# EAGLE design Terminal Batere (EAGLE 5.06)
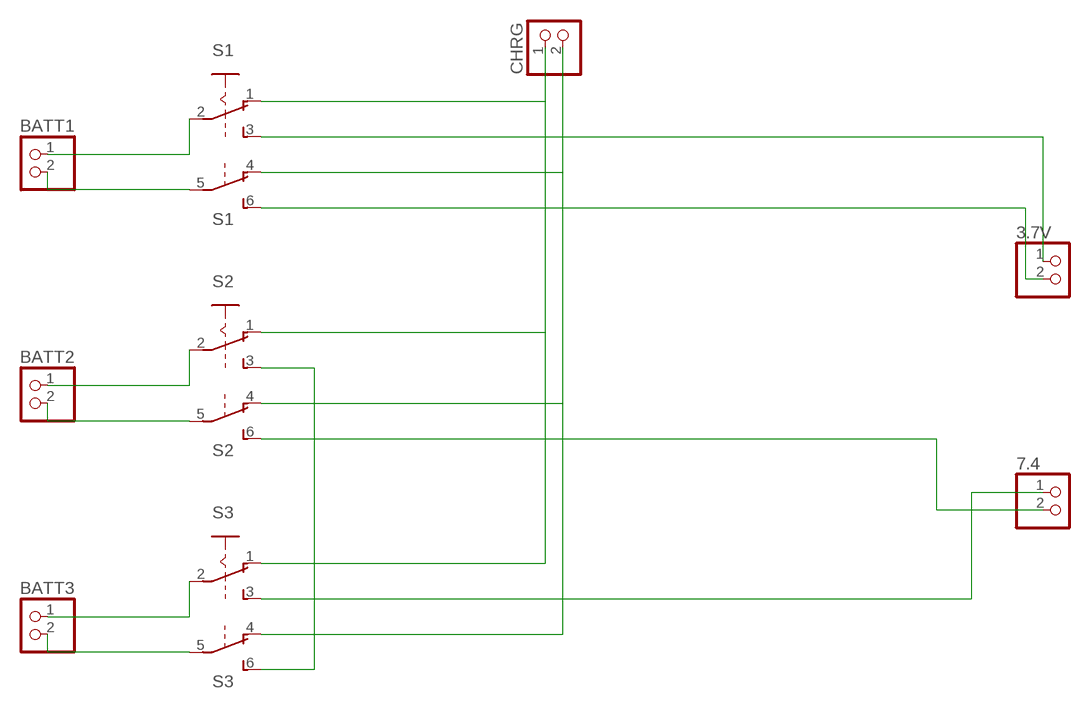
[diagram p0: schematic, sheet 1]

## Parts
3.7V  PINHD-1X2  [1X02]
7.4  PINHD-1X2  [1X02]
BATT1  PINHD-1X2  [1X02]
BATT2  PINHD-1X2  [1X02]
BATT3  PINHD-1X2  [1X02]
CHRG  PINHD-1X2  [1X02]
S1  A68-A31  [A68-A31]
S2  A68-A31  [A68-A31]
S3  A68-A31  [A68-A31]

## Nets
N$1: BATT1.1 S1.2(A:P)
N$2: BATT1.2 S1.5(B:P)
N$3: BATT2.1 S2.2(A:P)
N$4: BATT2.2 S2.5(B:P)
N$5: BATT3.1 S3.2(A:P)
N$6: BATT3.2 S3.5(B:P)
N$7: CHRG.1 S1.1(A:O) S2.1(A:O) S3.1(A:O)
N$8: CHRG.2 S1.4(B:O) S2.4(B:O) S3.4(B:O)
N$9: 3.7V.1 S1.3(A:S)
N$10: 3.7V.2 S1.6(B:S)
N$11: S2.3(A:S) S3.6(B:S)
N$12: 7.4.2 S2.6(B:S)
N$13: 7.4.1 S3.3(A:S)

## Library data of the parts
3.7V 7.4 BATT1-BATT3 CHRG = pinhead:PINHD-1X2: PIN HEADER
S1-S3 = switch:A68-A31: SLIDING SWITCH Siemens, distributor Buerklin, 11G766

## Board
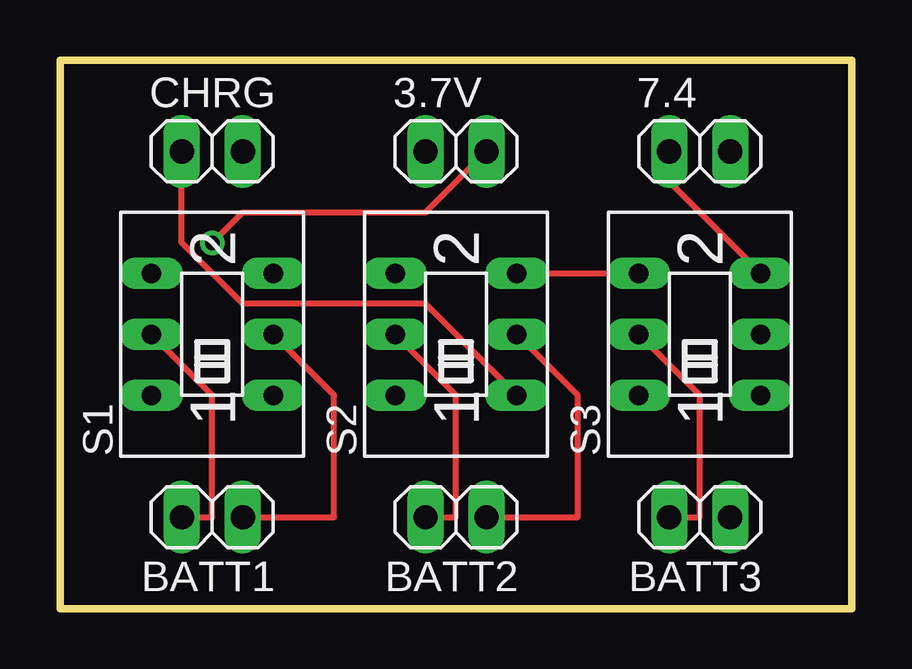
[diagram p1: board, top side]
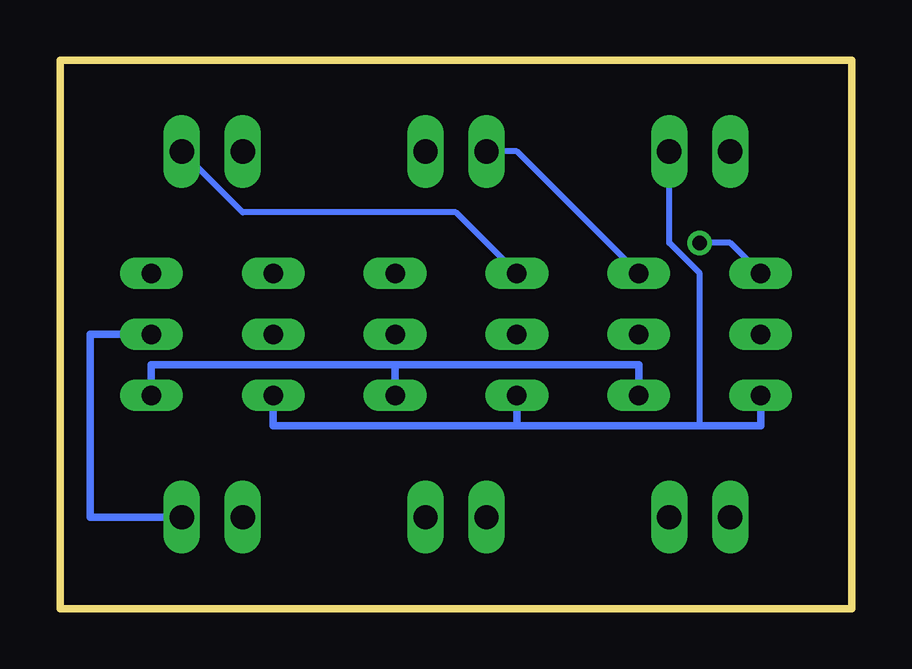
[diagram p2: board, bottom side, seen from below]

Size 33.02 x 22.86 mm. Coordinates in mm from the lower left corner, seen from the top.
Outline: 0,22.86 0,0 33.02,0 33.02,22.86 0,22.86
Copper layers (1*16): Top 0.035mm / dielectric 1.5mm / Bottom 0.035mm
Design rules "default": minimum track width 10mil, minimum drill 24mil, track to track 8mil, track to pad 8mil, pad to pad 8mil, via to via 8mil, smd to smd 8mil, copper to edge 40mil, drill to drill 8mil, minimum pad ring 10mil, minimum via ring 8mil, stop-mask expansion 4mil, vias tented up to drill 0mil, thermal gap 10mil

### Footprints (pad centres in the part's own frame; a part is rotated, then mirrored left to right if it is on the bottom)
1X02 = drill 1.016 long: 1 -1.27,0; 2 1.27,0
A68-A31 = drill 0.813 long: 1 -2.54,-2.54; 2 0,-2.54; 3 2.54,-2.54; 4 -2.54,2.54; 5 0,2.54; 6 2.54,2.54

### Placement (x,y rotation side)
3.7V  16.51,19.05 0 top
7.4  26.67,19.05 0 top
BATT1  6.35,3.81 180 top
BATT2  16.51,3.81 180 top
BATT3  26.67,3.81 180 top
CHRG  6.35,19.05 0 top
S1  6.35,11.43 90 top
S2  16.51,11.43 90 top
S3  26.67,11.43 90 top

### Tracks (layer width: path | path; a pad name or v marks a point on that pad's centre or on a via)
N$1
  Top 0.254: S1.2 11.43,8.89 11.43,3.81 BATT1.1
N$2
  Top 0.254: S1.5 6.35,8.89 6.35,3.81 BATT1.2
N$3
  Top 0.254: S2.2 21.59,8.89 21.59,3.81 BATT2.1
N$4
  Top 0.254: S2.5 16.51,8.89 16.51,3.81 BATT2.2
N$5
  Bottom 0.305: 30.48,11.43 S3.2 31.75,11.43 31.75,3.81 BATT3.1
N$6
  Top 0.254: S3.5 26.67,8.89 26.67,3.81 BATT3.2
N$7
  Top 0.254: CHRG.1 5.08,15.24 7.62,12.7 15.24,12.7 S2.1
  Bottom 0.305: S1.1 8.89,10.16 19.05,10.16 | 19.05,10.16 S2.1 | 19.05,10.16 29.21,10.16 S3.1
N$8
  Bottom 0.254: CHRG.2 7.62,15.24 6.35,13.97 6.35,7.62
  Bottom 0.305: S1.4 3.81,7.62 6.35,7.62 13.97,7.62 | 13.97,7.62 S2.4 | 13.97,7.62 24.13,7.62 S3.4
N$9
  Bottom 0.254: S1.3 13.97,19.05 3.7V.1
N$10  (via drill 0.61)
  Top 0.254: v6.35,15.24 7.62,16.51 15.24,16.51 3.7V.2
  Bottom 0.254: S1.6 5.08,15.24 v6.35,15.24
N$11
  Top 0.254: S2.3 S3.6
N$12
  Bottom 0.254: S2.6 16.51,16.51 25.4,16.51 7.4.2
N$13
  Top 0.254: S3.3 25.4,17.78 7.4.1